# EAGLE schematic BatterySuperCapBoard (EAGLE 6.5.0)
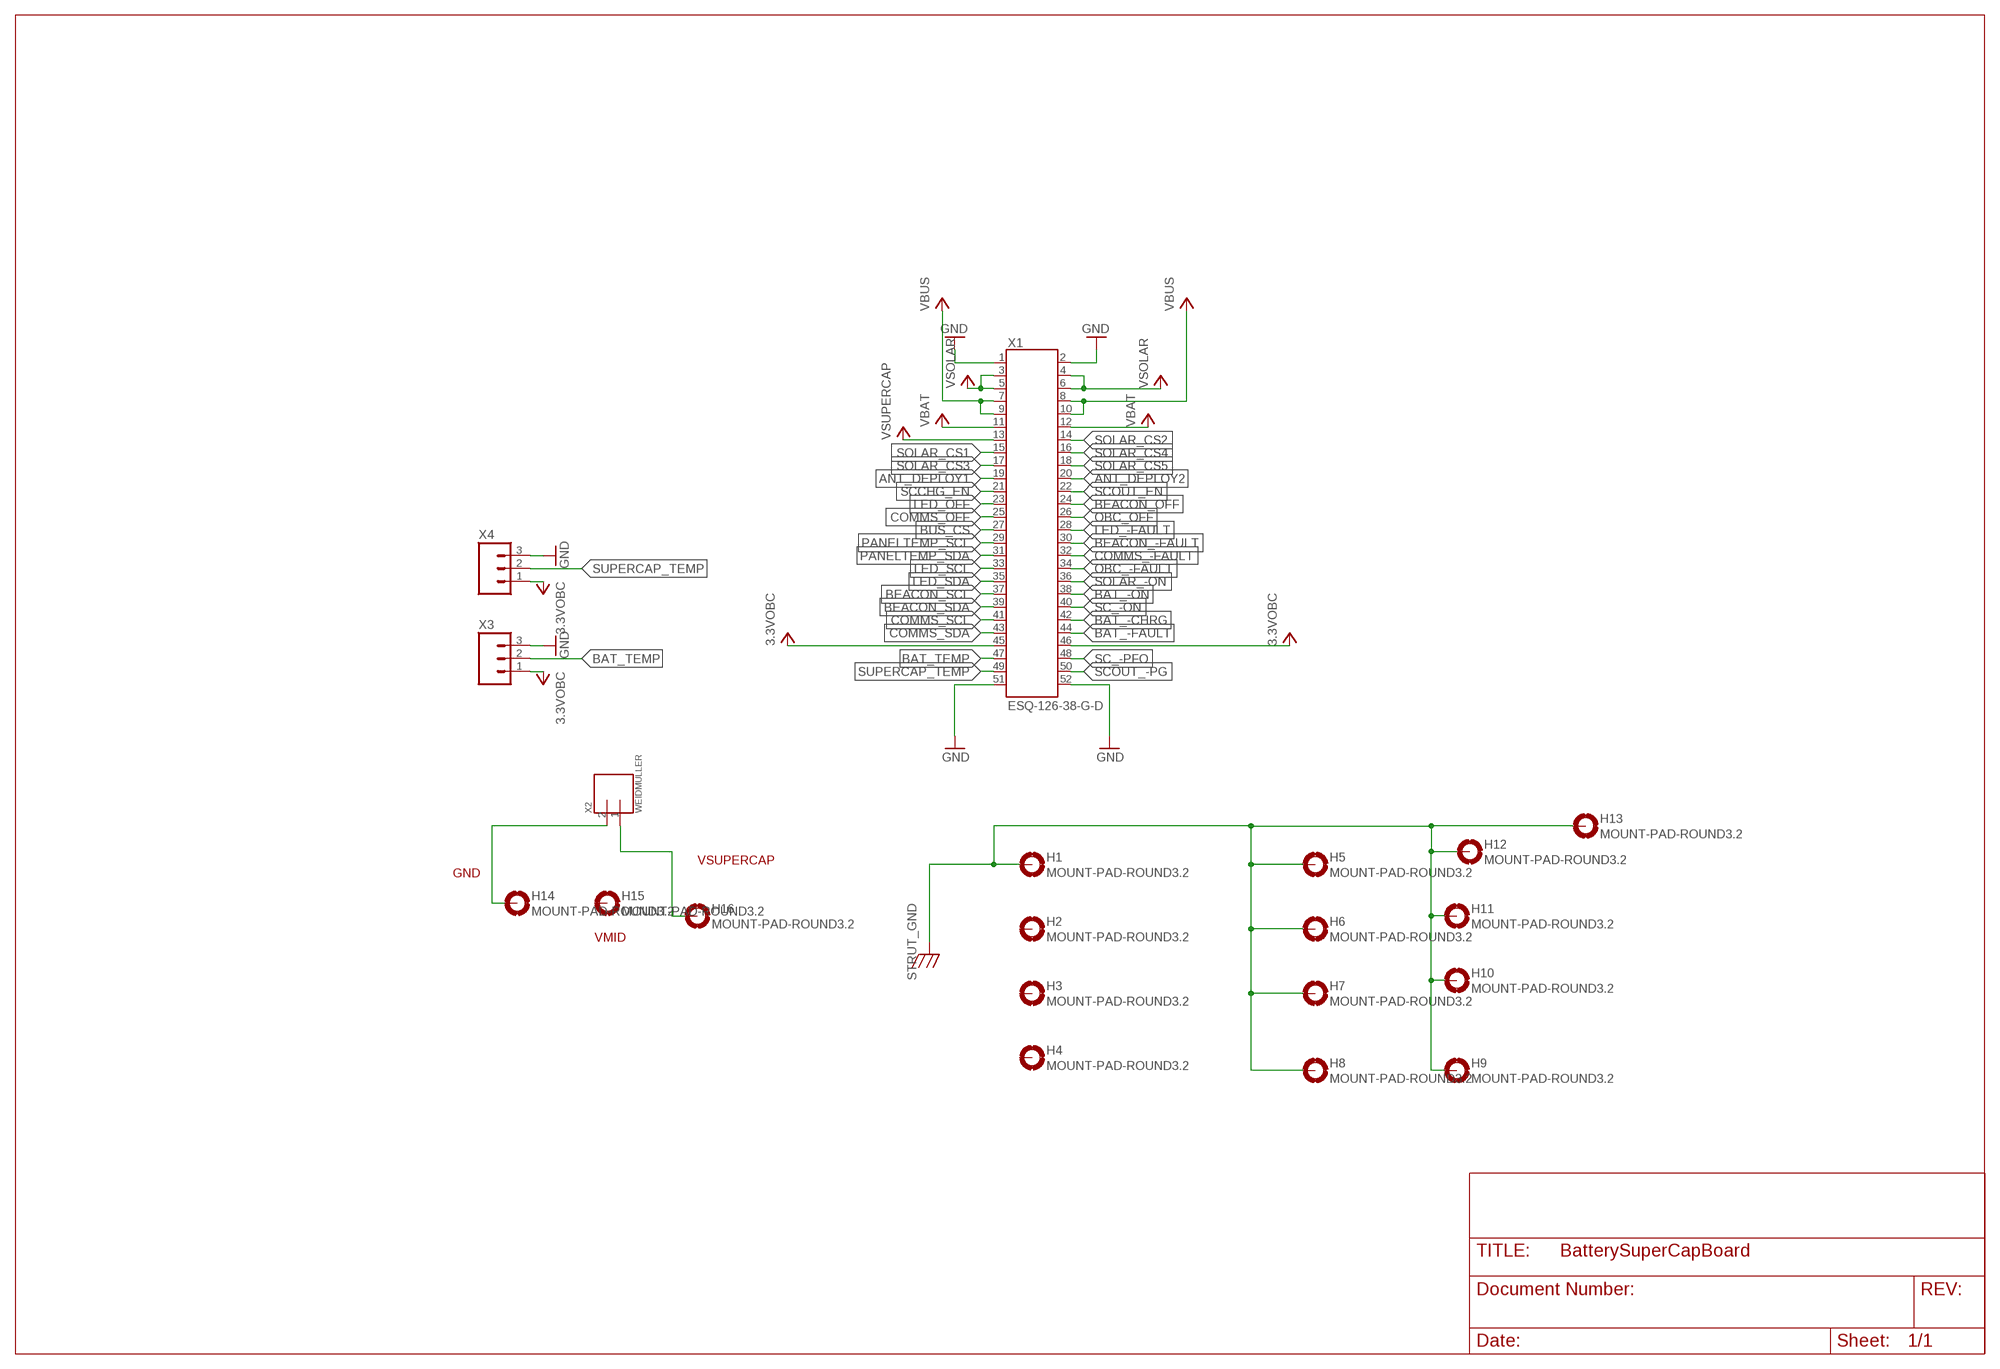
[diagram p0: schematic, sheet 1]

## Parts
H1  MOUNT-PAD-ROUND3.2  [3.2-PAD-ROUND]
H2  MOUNT-PAD-ROUND3.2  [3.2-PAD-ROUND]
H3  MOUNT-PAD-ROUND3.2  [3.2-PAD-ROUND]
H4  MOUNT-PAD-ROUND3.2  [3.2-PAD-ROUND]
H5  MOUNT-PAD-ROUND3.2  [3.2-PAD-ROUND]
H6  MOUNT-PAD-ROUND3.2  [3.2-PAD-ROUND]
H7  MOUNT-PAD-ROUND3.2  [3.2-PAD-ROUND]
H8  MOUNT-PAD-ROUND3.2  [3.2-PAD-ROUND]
H9  MOUNT-PAD-ROUND3.2  [3.2-PAD-ROUND]
H10  MOUNT-PAD-ROUND3.2  [3.2-PAD-ROUND]
H11  MOUNT-PAD-ROUND3.2  [3.2-PAD-ROUND]
H12  MOUNT-PAD-ROUND3.2  [3.2-PAD-ROUND]
H13  MOUNT-PAD-ROUND3.2  [3.2-PAD-ROUND]
H14  MOUNT-PAD-ROUND3.2  [3.2-PAD-ROUND]
H15  MOUNT-PAD-ROUND3.2  [3.2-PAD-ROUND]
H16  MOUNT-PAD-ROUND3.2  [3.2-PAD-ROUND]
X1  ESQ-126-38-G-D  [ESQ-126-XX-X-D]
X2  WEIDMULLER  [WEIDMULLER1760490000]
X3  M03PTH  [1X03]
X4  M03PTH  [1X03]

## Nets
3.3VOBC: X1.45 X1.46 X3.1 X4.1
ANT_DEPLOY1: X1.19
ANT_DEPLOY2: X1.20
BAT_-CHRG: X1.42
BAT_-FAULT: X1.44
BAT_-ON: X1.38
BAT_TEMP: X1.47 X3.2
BEACON_-FAULT: X1.30
BEACON_OFF: X1.24
BEACON_SCL: X1.37
BEACON_SDA: X1.39
BUS_CS: X1.27
COMMS_-FAULT: X1.32
COMMS_OFF: X1.25
COMMS_SCL: X1.41
COMMS_SDA: X1.43
GND: X1.1 X1.2 X1.51 X1.52 X3.3 X4.3
LED_-FAULT: X1.28
LED_OFF: X1.23
LED_SCL: X1.33
LED_SDA: X1.35
N$1: H14.B3,2(MOUNT) X2.2
N$2: H16.B3,2(MOUNT) X2.1
OBC_-FAULT: X1.34
OBC_OFF: X1.26
PANELTEMP_SCL: X1.29
PANELTEMP_SDA: X1.31
SC_-ON: X1.40
SC_-PFO: X1.48
SCCHG_EN: X1.21
SCOUT_-PG: X1.50
SCOUT_EN: X1.22
SOLAR_-ON: X1.36
SOLAR_CS1: X1.15
SOLAR_CS2: X1.14
SOLAR_CS3: X1.17
SOLAR_CS4: X1.16
SOLAR_CS5: X1.18
STRUT_GND: H1.B3,2(MOUNT) H5.B3,2(MOUNT) H6.B3,2(MOUNT) H7.B3,2(MOUNT) H8.B3,2(MOUNT) H9.B3,2(MOUNT) H10.B3,2(MOUNT) H11.B3,2(MOUNT) H12.B3,2(MOUNT) H13.B3,2(MOUNT)
SUPERCAP_TEMP: X1.49 X4.2
VBAT: X1.11 X1.12
VBUS: X1.7 X1.8 X1.9 X1.10
VSOLAR: X1.3 X1.4 X1.5 X1.6
VSUPERCAP: X1.13
Unconnected: H2.B3,2(MOUNT) H3.B3,2(MOUNT) H4.B3,2(MOUNT) H15.B3,2(MOUNT)

## Notes on the sheet
- VSUPERCAP
- GND
- VMID

## Library data of the parts
H1-H16 = OSSI:MOUNT-PAD-ROUND
X1 = OSSI:ESQ-126-: Samtec ESQ-126-XX-G-D Elevated Sockets Seires ESQ-126-37-G-D ESQ-126-38-G-D ESQ-126-39-G-D
X2 = OSSI:WEIDMULLER
X3 X4 = OSSI:M03: Header 3 Standard 3-pin 0.1" header. Use with straight break away headers (SKU : PRT-00116), right angle break away headers (PRT-00553), swiss pins (PRT-00743), machine pins (PRT-00117), and female headers (PRT-00115). Molex polarized connector foot print use with SKU : PRT-08232 with associated crimp pins and housings.